# Altium schematic sheet TOP.SchDoc: FMC 5GS/s ADC/TDC
size 420 x 297 mm; Author: Agnieszka Bartkowicz; CompanyName: WUT ISE; DrawnBy: Agnieszka Bartkowicz; Engineer: Agnieszka Bartkowicz; Organization: WUT ISE; Address1: PW ISE; Address2: Nowowiejska 15/19 00-665 Warsaw; Address3: gyorka@o2.pl; SheetNumber: 1; SheetTotal: 14; ModifiedBy: -; CheckedDate: -; Title2: Title 2; DivGrp: WUT ISE; Designer: A. Bartkowicz
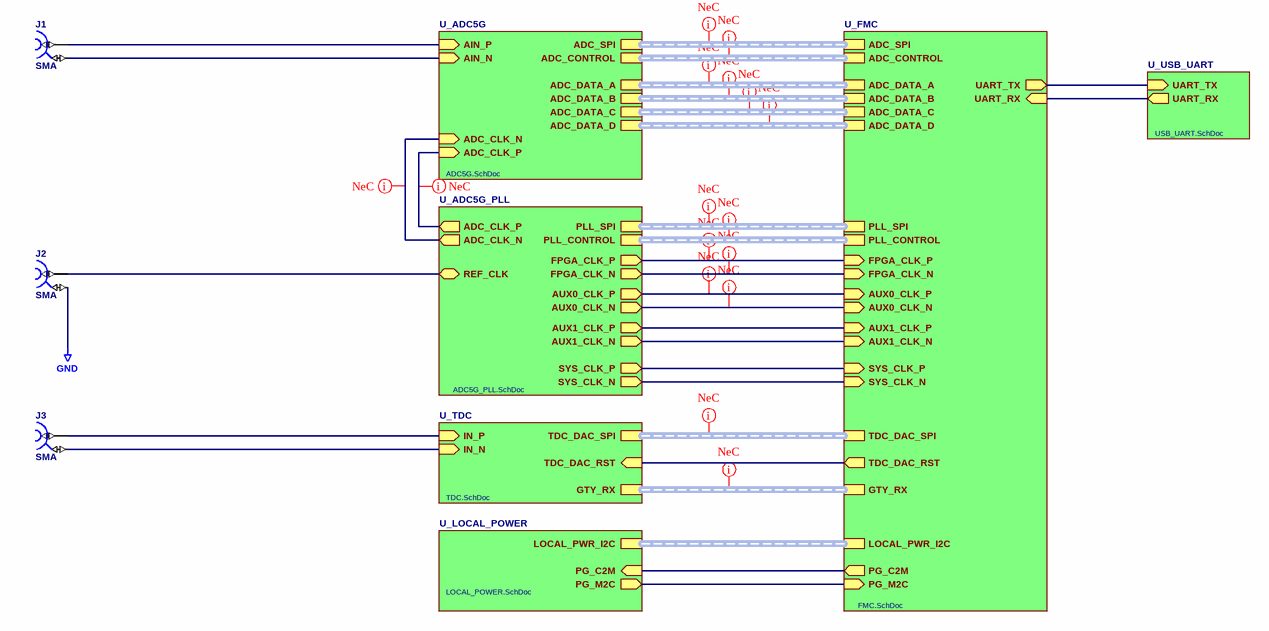
[diagram p0: TOP.SchDoc]

## Parts
J1  SMA  [SAMTEC_SMA-J-P-H-RA-TH1]
J2  SMA  [SAMTEC_SMA-J-P-H-RA-TH1]
J3  SMA  [SAMTEC_SMA-J-P-H-RA-TH1]

## Sub-sheets
U_ADC5G = ADC5G.SchDoc: ADC_SPI (harness SPI), ADC_CONTROL (harness ADC_CONTROL), ADC_CLK_P (in), ADC_CLK_N (in), ADC_DATA_A (harness ADC_DATA), ADC_DATA_B (harness ADC_DATA), ADC_DATA_C (harness ADC_DATA), ADC_DATA_D (harness ADC_DATA), AIN_N (in), AIN_P (in)
U_ADC5G_PLL = ADC5G_PLL.SchDoc: ADC_CLK_P (out), ADC_CLK_N (out), PLL_SPI (harness PLL_SPI), PLL_CONTROL (harness PLL_CONTROL), FPGA_CLK_P (out), FPGA_CLK_N (out), SYS_CLK_P (out), SYS_CLK_N (out), REF_CLK (bidir), AUX0_CLK_P (out), AUX0_CLK_N (out), AUX1_CLK_P (out), AUX1_CLK_N (out)
U_FMC = FMC.SchDoc: ADC_DATA_A (harness ADC_DATA), ADC_DATA_B (harness ADC_DATA), ADC_DATA_D (harness ADC_DATA), ADC_DATA_C (harness ADC_DATA), ADC_SPI (harness SPI), ADC_CONTROL (harness ADC_CONTROL), PLL_SPI (harness PLL_SPI), PLL_CONTROL (harness PLL_CONTROL), TDC_DAC_SPI (harness SPI), GTY_RX (harness GTY_RX), FPGA_CLK_P (in), FPGA_CLK_N (in), AUX0_CLK_P (in), AUX0_CLK_N (in), PG_M2C (in), PG_C2M (out), AUX1_CLK_N (in), AUX1_CLK_P (in), SYS_CLK_P (in), SYS_CLK_N (in), LOCAL_PWR_I2C (harness I2C), UART_TX (out), UART_RX (in), TDC_DAC_RST (out)
U_LOCAL_POWER = LOCAL_POWER.SchDoc: PG_C2M (in), PG_M2C (out), LOCAL_PWR_I2C (harness I2C)
U_TDC = TDC.SchDoc: TDC_DAC_SPI (harness I2C), IN_P (in), IN_N (in), GTY_RX (harness GTY_RX), TDC_DAC_RST (in)
U_USB_UART = USB_UART.SchDoc: UART_TX (in), UART_RX (out)

## Nets
GND: J2.2
NetJ1_1: J1.1 ; sheet U_ADC5G/AIN_P
NetJ1_2: J1.2 ; sheet U_ADC5G/AIN_N
NetJ2_1: J2.1 ; sheet U_ADC5G_PLL/REF_CLK
NetJ3_1: J3.1 ; sheet U_TDC/IN_P
NetJ3_2: J3.2 ; sheet U_TDC/IN_N
(unnamed): sheet U_ADC5G/ADC_CLK_P, sheet U_ADC5G_PLL/ADC_CLK_P
(unnamed): sheet U_ADC5G/ADC_CLK_N, sheet U_ADC5G_PLL/ADC_CLK_N
(unnamed): sheet U_ADC5G_PLL/FPGA_CLK_P, sheet U_FMC/FPGA_CLK_P
(unnamed): sheet U_ADC5G_PLL/FPGA_CLK_N, sheet U_FMC/FPGA_CLK_N
(unnamed): sheet U_ADC5G_PLL/SYS_CLK_P, sheet U_FMC/SYS_CLK_P
(unnamed): sheet U_ADC5G_PLL/SYS_CLK_N, sheet U_FMC/SYS_CLK_N
(unnamed): sheet U_ADC5G_PLL/AUX0_CLK_P, sheet U_FMC/AUX0_CLK_P
(unnamed): sheet U_ADC5G_PLL/AUX0_CLK_N, sheet U_FMC/AUX0_CLK_N
(unnamed): sheet U_ADC5G_PLL/AUX1_CLK_P, sheet U_FMC/AUX1_CLK_P
(unnamed): sheet U_ADC5G_PLL/AUX1_CLK_N, sheet U_FMC/AUX1_CLK_N
(unnamed): sheet U_FMC/PG_M2C, sheet U_LOCAL_POWER/PG_M2C
(unnamed): sheet U_FMC/PG_C2M, sheet U_LOCAL_POWER/PG_C2M
(unnamed): sheet U_FMC/UART_TX, sheet U_USB_UART/UART_TX
(unnamed): sheet U_FMC/UART_RX, sheet U_USB_UART/UART_RX
(unnamed): sheet U_FMC/TDC_DAC_RST, sheet U_TDC/TDC_DAC_RST

## Buses and harness runs
harness sheet U_ADC5G/ADC_CONTROL = sheet U_FMC/ADC_CONTROL
harness sheet U_ADC5G/ADC_DATA_A = sheet U_FMC/ADC_DATA_A
harness sheet U_ADC5G/ADC_DATA_B = sheet U_FMC/ADC_DATA_B
harness sheet U_ADC5G/ADC_DATA_C = sheet U_FMC/ADC_DATA_C
harness sheet U_ADC5G/ADC_DATA_D = sheet U_FMC/ADC_DATA_D
harness sheet U_ADC5G/ADC_SPI = sheet U_FMC/ADC_SPI
harness sheet U_ADC5G_PLL/PLL_CONTROL = sheet U_FMC/PLL_CONTROL
harness sheet U_ADC5G_PLL/PLL_SPI = sheet U_FMC/PLL_SPI
harness sheet U_FMC/GTY_RX = sheet U_TDC/GTY_RX
harness sheet U_FMC/LOCAL_PWR_I2C = sheet U_LOCAL_POWER/LOCAL_PWR_I2C
harness sheet U_FMC/TDC_DAC_SPI = sheet U_TDC/TDC_DAC_SPI

## Layout directives
net class ADC_SPI: (no net found under the mark)
net class ADC_CONTROL: (no net found under the mark)
net class ADC_DATA_A: (no net found under the mark)
net class ADC_DATA_B: (no net found under the mark)
net class ADC_DATA_C: (no net found under the mark)
net class ADC_DATA_D: (no net found under the mark)
net class PLL_SPI: (no net found under the mark)
net class PLL_CONTROL: (no net found under the mark)
net class CLOCKS: (no net found under the mark)
net class TRANSCIVERS: (no net found under the mark)
net class I2C: (no net found under the mark)

## Notes on the sheet
- Project/Equipment
- Document
- Designer
- Drawn by
- Check.by
- Copyright WUT ISE 2024.
  This documentation describes Open Hardware and is licensed under the CERN OHL v.2. You may redistribute and modify this documentation under the terms of the CERN OHL v.2. (http://ohwr.org/CERNOHL). This documentation is distributed WITHOUT ANY EXPRESS OR IMPLIED WARRANTY, INCLUDING OF MERCHANTABILITY, SATISFACTORY QUALITY AND FITNESS FOR A PARTICULAR PURPOSE. Please see the CERN OHL v.2 for applicable conditions.
- Contact
- File
- Last Mod.
- Print Date
- Sheet
- Size
- A3
- of
- Rev

## Library data of the parts
J1-J3 = SAMTEC_SMA-J-P-H-RA-TH1: Part Description: 50 Ohms SMA Right Angle Through-hole PCB Jack; Manufacturer: SAMTEC; PressFit: No; Part Number: SAMTEC_SMA-J-P-H-RA-TH1; Component Kind: Standard; Component Type: Standard; Pin Count: 5; Family: SMA; Mounted: Yes; Socket: No; SMD: No; Sense: No; Status: None; Manufacturer Part Number: SMA-J-P-H-RA-TH1; ComponentHeight: 13.8mm; HelpURL: \\cern.ch\dfs\Applications\Altium\Datasheets\SAMTEC_SMA-J-P-H-RA-TH1.pdf; Author: CERN DEM BC; CreateDate: 11.01.2021; LatestRevisionDate: 11.01.2021